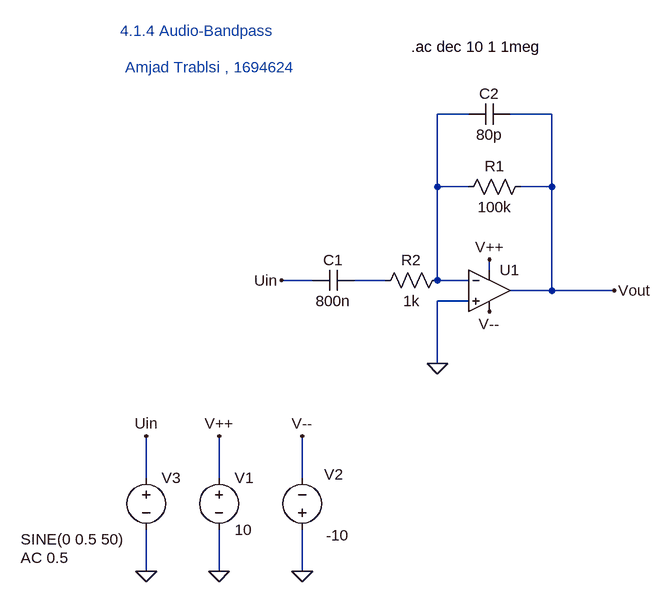
[diagram p0: schematic AudioBandPass.asc]
AudioBandPass.asc, the LTspice schematic file:
Version 4
SHEET 1 880 680
WIRE 368 -160 320 -160
WIRE 496 -160 432 -160
WIRE 320 -48 320 -160
WIRE 368 -48 320 -48
WIRE 496 -48 496 -160
WIRE 496 -48 448 -48
WIRE 400 80 400 64
WIRE 128 96 80 96
WIRE 240 96 192 96
WIRE 320 96 320 -48
WIRE 368 96 320 96
WIRE 496 112 496 -48
WIRE 496 112 432 112
WIRE 592 112 496 112
WIRE 368 128 320 128
WIRE 320 224 320 128
WIRE -128 400 -128 336
WIRE -16 400 -16 336
WIRE 112 400 112 336
WIRE -128 544 -128 480
WIRE -16 544 -16 480
WIRE 112 544 112 480
FLAG -16 544 0
FLAG -16 336 V++
FLAG 400 64 V++
FLAG 112 544 0
FLAG 112 336 V--
FLAG 400 144 V--
FLAG 592 112 Vout
FLAG -128 544 0
FLAG -128 336 Uin
FLAG 80 96 Uin
FLAG 320 224 0
SYMBOL res 464 -64 R90
WINDOW 0 0 56 VBottom 2
WINDOW 3 32 56 VTop 2
SYMATTR InstName R1
SYMATTR Value 100k
SYMBOL voltage -16 384 R0
WINDOW 123 0 0 Left 0
WINDOW 39 0 0 Left 0
SYMATTR InstName V1
SYMATTR Value 10
SYMBOL voltage 112 496 R180
WINDOW 0 -63 101 Left 2
WINDOW 3 -72 7 Left 2
WINDOW 123 0 0 Left 0
WINDOW 39 0 0 Left 0
SYMATTR InstName V2
SYMATTR Value -10
SYMBOL voltage -128 384 R0
WINDOW 3 -193 111 Left 2
WINDOW 123 -193 139 Left 2
WINDOW 39 0 0 Left 0
SYMATTR Value SINE(0 0.5 50)
SYMATTR Value2 AC 0.5
SYMATTR InstName V3
SYMBOL cap 192 80 R90
WINDOW 0 0 32 VBottom 2
WINDOW 3 32 32 VTop 2
SYMATTR InstName C1
SYMATTR Value 800n
SYMBOL res 336 80 R90
WINDOW 0 0 56 VBottom 2
WINDOW 3 32 56 VTop 2
SYMATTR InstName R2
SYMATTR Value 1k
SYMBOL cap 432 -176 R90
WINDOW 0 0 32 VBottom 2
WINDOW 3 32 32 VTop 2
SYMATTR InstName C2
SYMATTR Value 80p
SYMBOL OpAmps/UniversalOpAmp 400 112 R0
SYMATTR InstName U1
TEXT -168 -288 Left 2 ;4.1.4 Audio-Bandpass
TEXT 280 -264 Left 2 !.ac dec 10 1 1meg
TEXT -160 -232 Left 2 ;Amjad Trablsi , 1694624

The netlist it stands for:
* AudioBandPass.asc
R1 Vout N001 100k
V1 V++ 0 10
V2 0 V-- -10
V3 Uin 0 SINE(0 0.5 50) AC 0.5
C1 N002 Uin 800n
R2 N001 N002 1k
C2 Vout N001 80p
XU1 0 N001 V++ V-- Vout level1 Avol=1Meg GBW=10Meg Vos=0 En=0 Enk=0 In=0 Ink=0 Rin=500Meg  ; pins In+ In- V+ V- OUT
* 4.1.4 Audio-Bandpass
.ac dec 10 1 1meg
* Amjad Trablsi , 1694624
.lib UniversalOpAmp1.lib
.backanno
.end